# EAGLE design trinky (EAGLE 6.5.0)
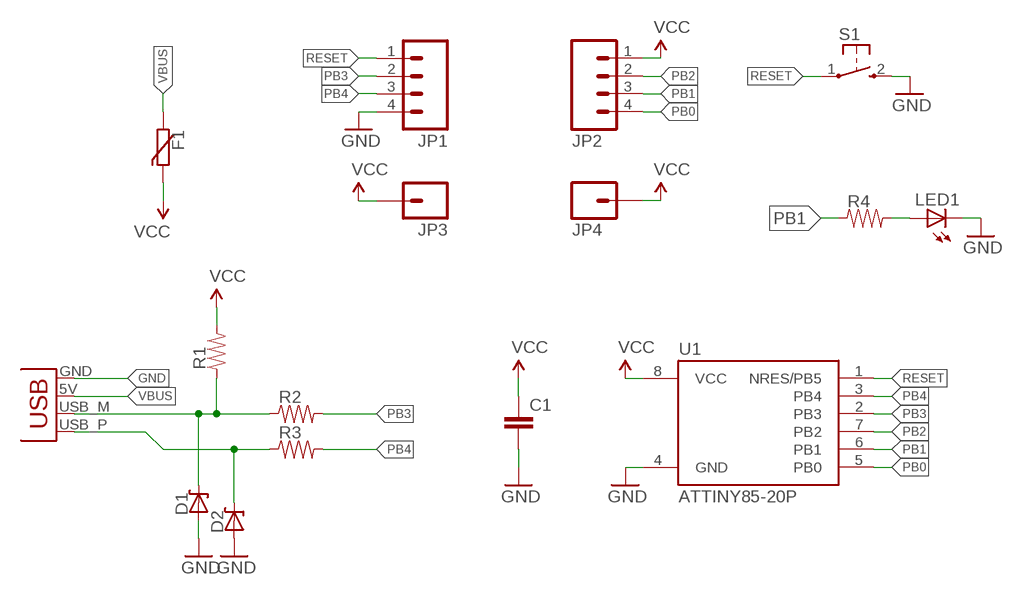
[diagram p0: schematic, sheet 1]

## Parts
C1  CAPEZ  [CAP-PTH-SMALLEZ]
D1  ZENER-DIODE-AXIAL-0.385  [SMALL-DIODE-0.385]
D2  ZENER-DIODE-AXIAL-0.3  [SMALL-DIODE-0.3]
F1  1812-RESETABLE-POLYFUSE  [1812-PTC-POLYFUSE]
JP1  M04LONGPADS  [1X04_LONGPADS]
JP2  M04LONGPADS  [1X04_LONGPADS]
JP3  M01PTH_LONGPAD  [1X01_LONGPAD]
JP4  M01PTH_LONGPAD  [1X01_LONGPAD]
JP5  USBPCB  [USB-A-PCB]
LED1  LED3MM  [LED3MM]
R1  RESISTOR-AXIAL-0.2  [AXIAL-0.2]
R2  RESISTOR-AXIAL-0.4  [AXIAL-0.4]
R3  RESISTOR-AXIAL-0.4  [AXIAL-0.4]
R4  RESISTOR-AXIAL-0.3  [AXIAL-0.3]
S1  TACTILE-SWITCH-2PINS-REMOVED  [BUTTON-2PINS-REMOVED]
U1  ATTINY85-20P  [PDIP08_300MIL]

## Nets
D+: D2.P$2 JP5.USB_P(D+) R3.P$1
D-: D1.P$2 JP5.USB_M(D-) R1.P$1 R2.P$1
GND: C1.2 D1.P$1 D2.P$1 JP1.4 JP5.GND LED1.K(C) S1.2 U1.4(GND)
N$3: LED1.A R4.P$2
PB0: JP2.4 U1.5(PB0)
PB1: JP2.3 R4.P$1 U1.6(PB1)
PB2: JP2.2 U1.7(PB2)
PB3: JP1.2 R2.P$2 U1.2(PB3)
PB4: JP1.3 R3.P$2 U1.3(PB4)
RESET: JP1.1 S1.1 U1.1(NRES/PB5)
VBUS: F1.P$1 JP5.5V(VBUS)
VCC: C1.1 F1.P$2 JP2.1 JP3.1 JP4.1 R1.P$2 U1.8(VCC)

## Library data of the parts
C1 = SparkFun-Capacitors:CAP: Capacitor Standard 0603 ceramic capacitor, and 0.1" leaded capacitor.
D1 = 1-gerben:ZENER-DIODE-AXIAL-0.385
D2 = 1-gerben:ZENER-DIODE-AXIAL-0.3
F1 = gerben:1812-RESETABLE-POLYFUSE
JP1 JP2 = SparkFun-Connectors:M04: Header 4 Standard 4-pin 0.1" header. Use with straight break away headers (SKU : PRT-00116), right angle break away headers (PRT-00553), swiss pins (PRT-00743), machine pins (PRT-00117), and female headers (PRT-00115). Molex polarized connector foot print use with SKU : PRT-08231 with associated crimp pins and housings. 1MM SMD Version SKU: PRT-10208
JP3 JP4 = SparkFun-Connectors:M01: Header 1 Standard 1-pin 0.1" header. Use with straight break away headers (SKU : PRT-00116), right angle break away headers (PRT-00553), swiss pins (PRT-00743), machine pins (PRT-00117), and female headers (PRT-00115).
JP5 = SparkFun-Connectors:USB: USB Connectors USB-B-PTH is fully proven SKU : PRT-00139/CONN-08278 USB-miniB is fully proven SKU : PRT-00587 USB-A-PCB is untested. USB-A-H is throughly reviewed, but untested. Spark Fun Electronics SKU : PRT-00437 USB-B-SMT is throughly reviewed, but untested. Needs silkscreen touching up. USB-A-S has not been used/tested USB-MB-H has not been used/tested USB-MICROB has been used. CONN-09505
LED1 = adafruit:LED: LED OSRAM: - CHIPLED LG R971, LG N971, LY N971, LG Q971, LY Q971, LO R971, LY R971 LH N974, LH R974 LS Q976, LO Q976, LY Q976 LO Q996 - Hyper CHIPLED LW Q18S LB Q993, LB Q99A, LB R99A - SideLED LS A670, LO A670, LY A670, LG A670, LP A670 LB A673, LV A673, LT A673, LW A673 LH A674 LY A675 LS A676, LA A676, LO A676, LY A676, LW A676 LS A679, LY A679, LG A679 - Hyper Micro SIDELED® LS Y876, LA Y876, LO Y876, LY Y876 LT Y87S - SmartLED LW L88C, LW L88S LB L89C, LB L89S, LG L890 LS L89K, LO L89K, LY L89K LS L896, LA L896, LO L896, LY L896 - TOPLED LS T670, LO T670, LY T670, LG T670, LP T670 LSG T670, LSP T670, LSY T670, LOP T670, LYG T670 LG T671, LOG T671, LSG T671 LB T673, LV T673, LT T673, LW T673 LH T674 LS T676, LA T676, LO T676, LY T676, LB T676, LH T676, LSB T676, LW T676 LB T67C, LV T67C, LT T67C, LS T67K, LO T67K, LY T67K, LW E67C LS E67B, LA E67B, LO E67B, LY E67B, LB E67C, LV E67C, LT E67C LW T67C LS T679, LY T679, LG T679 LS T770, LO T770, LY T770, LG T770, LP T770 LB T773, LV T773, LT T773, LW T773 LH T774 LS E675, LA E675, LY E675, LS T675 LS T776, LA T776, LO T776, LY T776, LB T776 LHGB T686 LT T68C, LB T68C - Hyper Mini TOPLED® LB M676 - Mini TOPLED Santana® LG M470 LS M47K, LO M47K, LY M47K Source: http://www.osram.convergy.de/
R1 = 1-gerben:RESISTOR-AXIAL-0.2
R2 R3 = 1-gerben:RESISTOR-AXIAL-0.4
R4 = 1-gerben:RESISTOR-AXIAL-0.3
S1 = 1-gerben:TACTILE-SWITCH-2PINS-REMOVED
U1 = attiny25_45_85:ATTINY85*: ATMEL ATtiny 85 Packages: P = PDIP 08 30mil S = SOIC 08 EIAJ 208mil Technologies Note: for complete ordering code (temp. range, finish, tape&reel etc.) see www.atmel.com • Supply Voltage: V = (1.8…5.5)V | [blank] = (2.7…5.5)V • Speed: 10 = 10 MHz | 20 = 20 MHz Author: Dipl.-Ing. FH Rainer Bayer HHN Hochschule Heilbronn (Heilbronn University), rainer.bayer@hs-heilbronn.de Ingenieurbüro ing-rb, mail@ing-rb.de

## Board
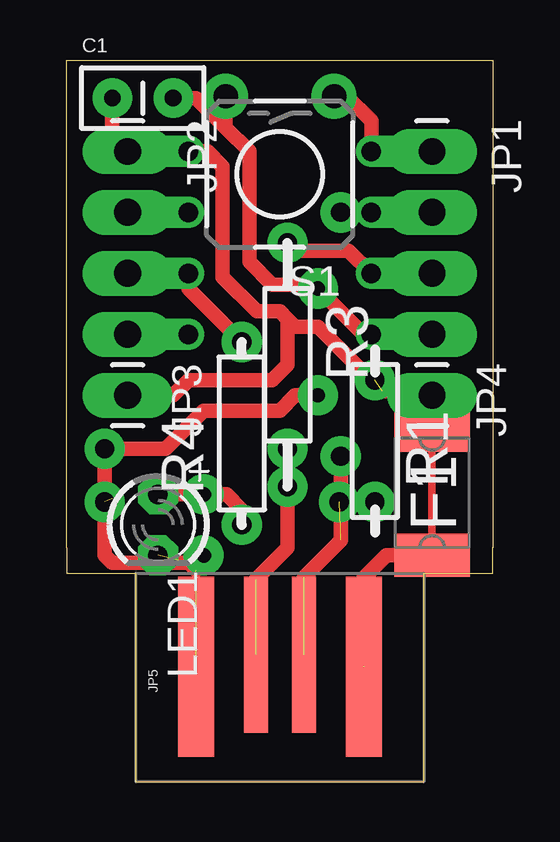
[diagram p1: board, top side]
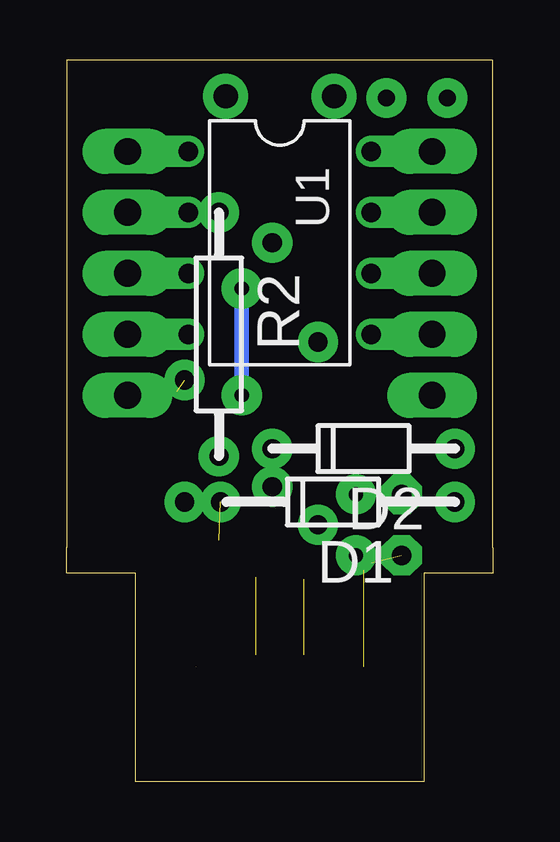
[diagram p2: board, bottom side, seen from below]

Size 17.78 x 30.08 mm. Coordinates in mm from the lower left corner, seen from the top.
Outline: 17.78,9.76 17.78,30.08 0,30.08 0,9.76
Outline: 0,9.75 0,8.7 2.88,8.7 2.88,0 14.89,0 14.89,8.7 17.78,8.7 17.78,9.78
Copper layers (1*16): Top 0.035mm / dielectric 1.5mm / Bottom 0.035mm
Design rules "default *": minimum track width 10mil, minimum drill 19mil, track to track 12mil, track to pad 12mil, pad to pad 12mil, via to via 12mil, smd to smd 8mil, copper to edge 40mil, drill to drill 19mil, minimum pad ring 10mil, minimum via ring 8mil, stop-mask expansion 4mil, vias tented up to drill 0mil, thermal gap 10mil

### Footprints (pad centres in the part's own frame; a part is rotated, then mirrored left to right if it is on the bottom)
CAP-PTH-SMALLEZ = drill 0.7 pad 1.651: 1 0,0; 2 2.54,0
SMALL-DIODE-0.385 = drill 0.8 pad 1.676: P$1 -5.08,0; P$2 4.699,0
SMALL-DIODE-0.3 = drill 0.8 pad 1.676: P$1 -3.81,0; P$2 3.81,0
1812-PTC-POLYFUSE = smd 1.778 x 3.15: P$1 -2.54,0; P$2 2.667,0
1X04_LONGPADS = drill 1.118 pad 1.88 long: 1 0,0; 2 2.54,0; 3 5.08,0; 4 7.62,0
1X01_LONGPAD = drill 1.118 pad 1.88 long: 1 0,0
USB-A-PCB = smd 7.5 x 1.5: 5V -0.2,-3.5; GND -0.2,3.5 | smd 6.5 x 1: USB_M 0.3,-1; USB_P 0.3,1
LED3MM = drill 0.813 pad 1.676 octagon: A -1.27,0; K 1.27,0
AXIAL-0.2 = drill 0.8 pad 1.676: P$1 2.54,0; P$2 -2.54,0
AXIAL-0.4 = drill 0.8 pad 1.676: P$1 5.08,0; P$2 -5.08,0
AXIAL-0.3 = drill 0.8 pad 1.676: P$1 3.81,0; P$2 -3.81,0
BUTTON-2PINS-REMOVED = drill 1.016 pad 1.88: 1 -2.261,-3.251; 2 2.261,-3.251
PDIP08_300MIL = drill 0.813 offset: 1 -3.81,-3.81; 2 -1.27,-3.81; 3 1.27,-3.81; 4 3.81,-3.81; 5 3.81,3.81; 6 1.27,3.81; 7 -1.27,3.81; 8 -3.81,3.81

### Placement (x,y rotation side)
C1  1.9,28.49 0 top
D1  6.67,11.66 180 bottom
D2  5.4,13.89 180 bottom
F1  15.24,11.98 90 top
JP1  15.24,26.27 270 top
JP2  2.54,26.27 270 top
JP3  2.54,16.11 270 top
JP4  15.24,16.11 270 top
JP5  8.89,5 90 top
LED1  3.81,10.71 270 top
R1  12.86,14.2 270 top
R2  11.43,18.65 270 bottom
R3  9.21,17.38 270 top
R4  7.3,14.52 90 top
S1  8.89,25.32 180 top
U1  8.89,22.46 270 bottom

### Tracks (layer width: path | path; a pad name or v marks a point on that pad's centre or on a via)
D+  (1 unrouted)
  Top 0.61: 7.89,8.44 9.21,9.76 R3.P$1 D2.P$2
D-  (2 unrouted)
  Top 0.61: 9.89,8.54 11.43,10.08 R2.P$1 | R1.P$1 D1.P$2
GND  (via drill 0.6 pad 1.68)  (4 unrouted)
  Top 0.61: JP1.4 U1.4 12.38,18.65 v10.48,20.55 10.32,20.71 8.57,20.71 7.62,21.67 7.62,26.27 6.63,27.26 | 5.39,8.81 5.08,9.12 1.9,9.12 1.59,9.44 D1.P$1 D2.P$1 4.13,13.89 5.71,15.47 8.89,15.47 9.53,16.11 v10.48,16.11 | C1.2 5.4,28.49 6.63,27.26 | S1.2 6.63,27.26
  Bottom 0.61: v10.48,20.55 v10.48,16.11
N$1
  Top 0.305: 15.24,9.12 15.24,13.89
N$2  (via drill 0.6 pad 1.68)
  other vias: 5.71,9.44
N$3
  Top 0.61: R4.P$2 7.3,11.35 6.67,11.98 LED1.A
N$4  (via drill 0.6 pad 1.68)
  other vias: 10.48,20.55
N$6  (via drill 0.6 pad 1.68)
  other vias: 5.71,11.98
PB0
  Top 0.61: U1.5 JP2.4
PB1
  Top 0.61: JP2.3 U1.6 5.08,20.55 R4.P$1
PB2
  Top 0.61: U1.7 JP2.2
PB3
  Top 0.61: JP1.2 U1.2 R2.P$2
PB4
  Top 0.61: JP1.3 U1.3 11.75,22.14 9.53,22.14 R3.P$2
RESET
  Top 0.61: JP1.1 U1.1 12.7,27.54 11.67,28.57 S1.1
VBUS  (1 unrouted)
  Top 0.61: F1.P$1 13.33,9.44 12.38,8.49 JP5.5V
VCC  (1 unrouted)
  Top 0.61: 13.97,14.2 15.05,14.2 F1.P$2 JP4.1 15.08,16.27 13.18,16.27 10.48,18.97 9.53,18.97 9.21,19.28 | JP3.1 4.44,16.11 5.08,16.74 8.57,16.74 9.21,17.38 9.21,19.28 | C1.1 1.9,26.9 JP2.1 U1.8 5.87,26.27 6.51,25.63 6.51,21.03 7.94,19.6 8.89,19.6 9.21,19.28